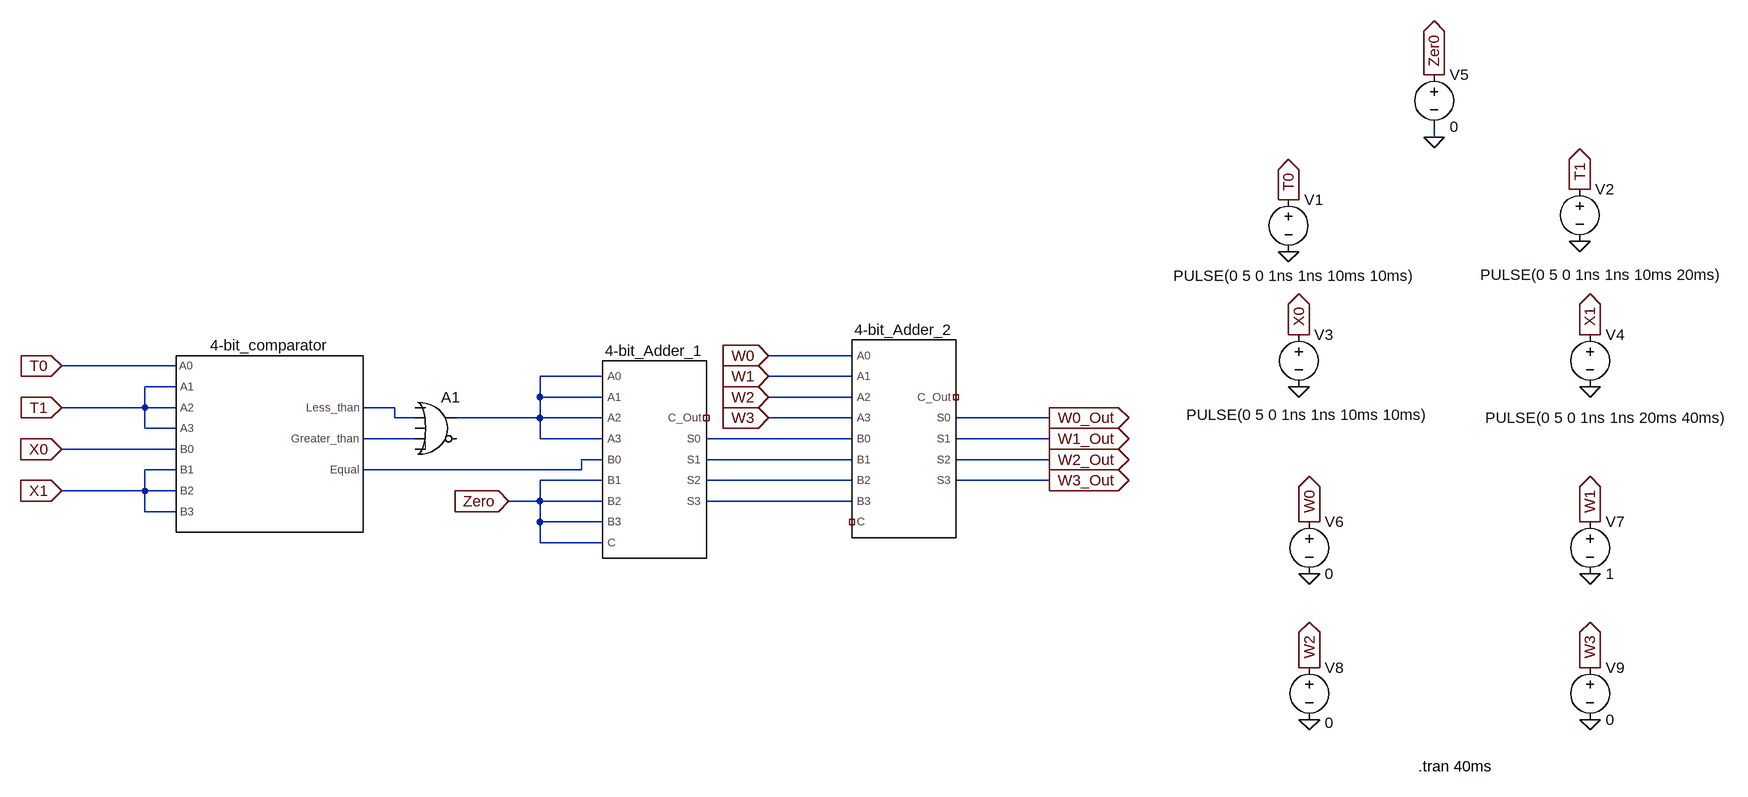
[diagram p0: schematic P2_Perceptron.asc]
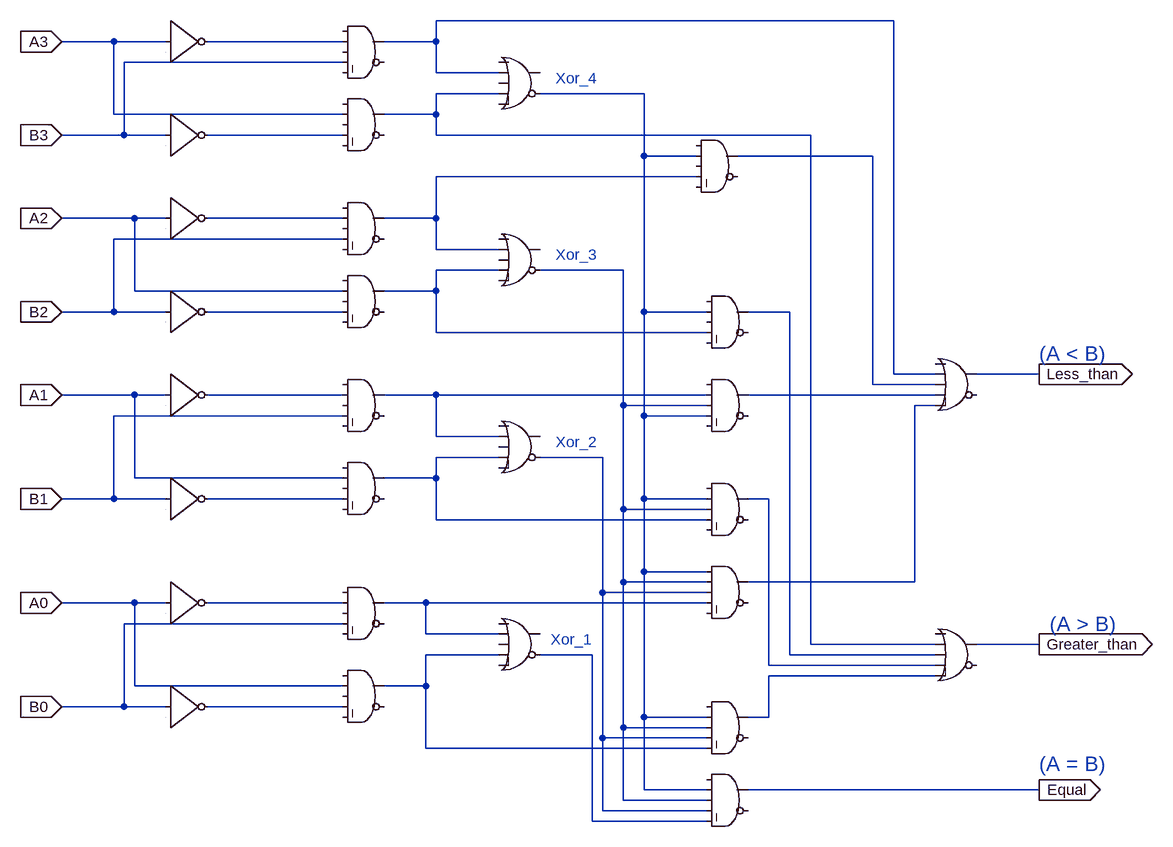
[diagram p1: sub-circuit 4-bit_comparator.asc]
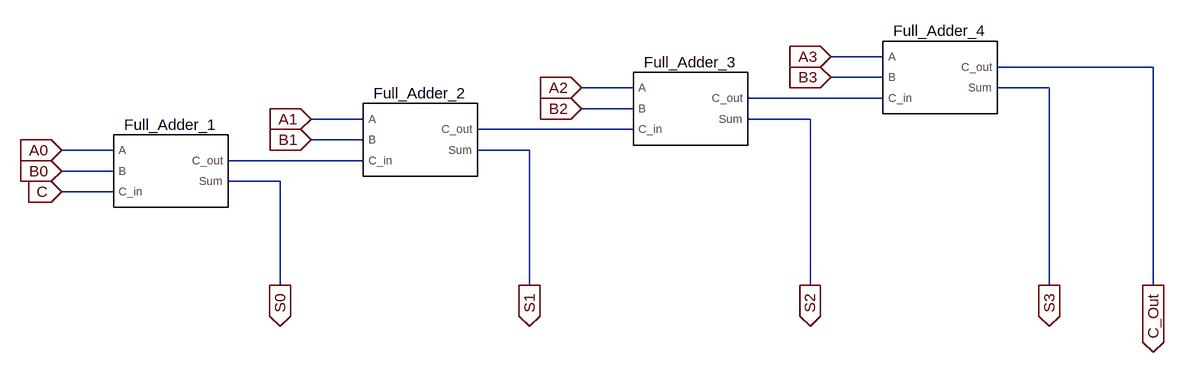
[diagram p2: sub-circuit 4-bit_adder.asc]
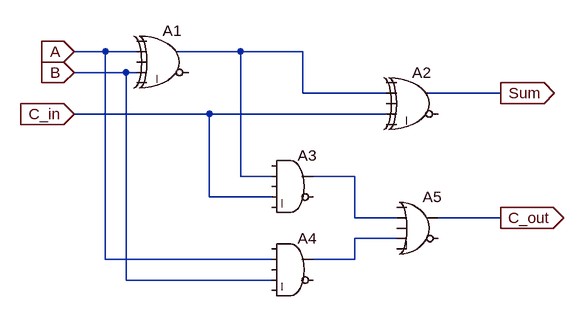
[diagram p3: sub-circuit full_adder.asc]
P2_Perceptron.asc, the LTspice schematic file:
Version 4
SHEET 1 2160 1016
WIRE 1488 -368 1488 -384
WIRE 592 -32 464 -32
WIRE -448 -16 -624 -16
WIRE 208 0 112 0
WIRE 592 0 464 0
WIRE -448 16 -496 16
WIRE 112 32 112 0
WIRE 208 32 112 32
WIRE 592 32 464 32
WIRE -496 48 -496 16
WIRE -496 48 -624 48
WIRE -448 48 -496 48
WIRE -112 48 -160 48
WIRE -112 64 -112 48
WIRE -80 64 -112 64
WIRE 112 64 112 32
WIRE 112 64 -16 64
WIRE 208 64 112 64
WIRE 592 64 464 64
WIRE 896 64 752 64
WIRE -496 80 -496 48
WIRE -448 80 -496 80
WIRE -80 96 -160 96
WIRE 112 96 112 64
WIRE 208 96 112 96
WIRE 592 96 368 96
WIRE 896 96 752 96
WIRE -448 112 -624 112
WIRE 208 128 176 128
WIRE 592 128 368 128
WIRE 896 128 752 128
WIRE -448 144 -496 144
WIRE 176 144 176 128
WIRE 176 144 -160 144
WIRE 208 160 112 160
WIRE 592 160 368 160
WIRE 896 160 752 160
WIRE -496 176 -496 144
WIRE -496 176 -624 176
WIRE -448 176 -496 176
WIRE 112 192 112 160
WIRE 112 192 64 192
WIRE 208 192 112 192
WIRE 592 192 368 192
WIRE -496 208 -496 176
WIRE -448 208 -496 208
WIRE 112 224 112 192
WIRE 208 224 112 224
WIRE 112 256 112 224
WIRE 208 256 112 256
FLAG -624 -16 T0
IOPIN -624 -16 In
FLAG -624 48 T1
IOPIN -624 48 In
FLAG -624 112 X0
IOPIN -624 112 In
FLAG -624 176 X1
IOPIN -624 176 In
FLAG 64 192 Zero
IOPIN 64 192 In
FLAG 464 -32 W0
IOPIN 464 -32 In
FLAG 464 0 W1
IOPIN 464 0 In
FLAG 464 32 W2
IOPIN 464 32 In
FLAG 464 64 W3
IOPIN 464 64 In
FLAG 896 64 W0_Out
IOPIN 896 64 Out
FLAG 896 96 W1_Out
IOPIN 896 96 Out
FLAG 896 128 W2_Out
IOPIN 896 128 Out
FLAG 896 160 W3_Out
IOPIN 896 160 Out
FLAG 1264 -192 0
FLAG 1712 -208 0
FLAG 1280 16 0
FLAG 1728 16 0
FLAG 1488 -368 0
FLAG 1728 528 0
FLAG 1296 528 0
FLAG 1728 304 0
FLAG 1296 304 0
FLAG 1264 -272 T0
IOPIN 1264 -272 Out
FLAG 1712 -288 T1
IOPIN 1712 -288 Out
FLAG 1280 -64 X0
IOPIN 1280 -64 Out
FLAG 1728 -64 X1
IOPIN 1728 -64 Out
FLAG 1488 -464 Zer0
IOPIN 1488 -464 Out
FLAG 1728 448 W3
IOPIN 1728 448 Out
FLAG 1296 448 W2
IOPIN 1296 448 Out
FLAG 1728 224 W1
IOPIN 1728 224 Out
FLAG 1296 224 W0
IOPIN 1296 224 Out
SYMBOL Digital\\or -48 16 R0
SYMATTR InstName A1
SYMBOL voltage 1264 -288 R0
WINDOW 3 -177 133 Left 2
WINDOW 123 0 0 Left 0
WINDOW 39 0 0 Left 0
SYMATTR Value PULSE(0 5 0 1ns 1ns 10ms 10ms)
SYMATTR InstName V1
SYMBOL voltage 1712 -304 R0
WINDOW 3 -153 148 Left 2
WINDOW 123 0 0 Left 0
WINDOW 39 0 0 Left 0
SYMATTR Value PULSE(0 5 0 1ns 1ns 10ms 20ms)
SYMATTR InstName V2
SYMBOL voltage 1280 -80 R0
WINDOW 3 -173 139 Left 2
WINDOW 123 0 0 Left 0
WINDOW 39 0 0 Left 0
SYMATTR Value PULSE(0 5 0 1ns 1ns 10ms 10ms)
SYMATTR InstName V3
SYMBOL voltage 1728 -80 R0
WINDOW 3 -161 144 Left 2
WINDOW 123 0 0 Left 0
WINDOW 39 0 0 Left 0
SYMATTR Value PULSE(0 5 0 1ns 1ns 20ms 40ms)
SYMATTR InstName V4
SYMBOL voltage 1488 -480 R0
WINDOW 123 0 0 Left 0
WINDOW 39 0 0 Left 0
SYMATTR InstName V5
SYMATTR Value 0
SYMBOL voltage 1296 208 R0
WINDOW 123 0 0 Left 0
WINDOW 39 0 0 Left 0
SYMATTR InstName V6
SYMATTR Value 0
SYMBOL voltage 1728 208 R0
WINDOW 123 0 0 Left 0
WINDOW 39 0 0 Left 0
SYMATTR InstName V7
SYMATTR Value 1
SYMBOL voltage 1296 432 R0
WINDOW 123 0 0 Left 0
WINDOW 39 0 0 Left 0
WINDOW 3 24 101 Left 2
SYMATTR Value 0
SYMATTR InstName V8
SYMBOL voltage 1728 432 R0
WINDOW 123 0 0 Left 0
WINDOW 39 0 0 Left 0
SYMATTR InstName V9
SYMATTR Value 0
SYMBOL 4-bit_comparator -336 96 R0
WINDOW 0 32 -128 Bottom 2
SYMATTR InstName 4-bit_comparator
SYMBOL 4-bit_Adder 256 128 R0
SYMATTR InstName 4-bit_Adder_1
SYMBOL 4-bit_Adder 640 96 R0
SYMATTR InstName 4-bit_Adder_2
TEXT 1464 600 Left 2 !.tran 40ms

4-bit_comparator.asc, the sub-circuit schematic file:
Version 4
SHEET 1 2408 1296
WIRE 1152 16 448 16
WIRE -48 48 -128 48
WIRE 32 48 -48 48
WIRE 304 48 96 48
WIRE 448 48 448 16
WIRE 448 48 368 48
WIRE 304 80 -32 80
WIRE 448 96 448 48
WIRE 544 96 448 96
WIRE 544 128 448 128
WIRE 768 128 608 128
WIRE -48 160 -48 48
WIRE 304 160 -48 160
WIRE 448 160 448 128
WIRE 448 160 368 160
WIRE -32 192 -32 80
WIRE -32 192 -128 192
WIRE 32 192 -32 192
WIRE 304 192 96 192
WIRE 448 192 448 160
WIRE 1024 192 448 192
WIRE 768 224 768 128
WIRE 848 224 768 224
WIRE 1120 224 912 224
WIRE 848 256 448 256
WIRE -16 320 -128 320
WIRE 32 320 -16 320
WIRE 304 320 96 320
WIRE 448 320 448 256
WIRE 448 320 368 320
WIRE 304 352 -48 352
WIRE 448 368 448 320
WIRE 544 368 448 368
WIRE 544 400 448 400
WIRE 736 400 608 400
WIRE -16 432 -16 320
WIRE 304 432 -16 432
WIRE 448 432 448 400
WIRE 448 432 368 432
WIRE -48 464 -48 352
WIRE -48 464 -128 464
WIRE 32 464 -48 464
WIRE 304 464 96 464
WIRE 768 464 768 224
WIRE 864 464 768 464
WIRE 992 464 928 464
WIRE 448 496 448 432
WIRE 864 496 448 496
WIRE 1152 560 1152 16
WIRE 1216 560 1152 560
WIRE 1376 560 1280 560
WIRE 1120 576 1120 224
WIRE 1216 576 1120 576
WIRE -16 592 -128 592
WIRE 32 592 -16 592
WIRE 304 592 96 592
WIRE 448 592 368 592
WIRE 864 592 448 592
WIRE 1216 592 928 592
WIRE 736 608 736 400
WIRE 864 608 736 608
WIRE 1216 608 1184 608
WIRE 304 624 -48 624
WIRE 768 624 768 464
WIRE 864 624 768 624
WIRE 448 656 448 592
WIRE 544 656 448 656
WIRE 544 688 448 688
WIRE 704 688 608 688
WIRE -16 720 -16 592
WIRE 304 720 -16 720
WIRE 448 720 448 688
WIRE 448 720 368 720
WIRE -48 752 -48 624
WIRE -48 752 -128 752
WIRE 32 752 -48 752
WIRE 304 752 96 752
WIRE 768 752 768 624
WIRE 864 752 768 752
WIRE 960 752 928 752
WIRE 736 768 736 608
WIRE 864 768 736 768
WIRE 448 784 448 720
WIRE 864 784 448 784
WIRE 768 864 768 752
WIRE 864 864 768 864
WIRE 736 880 736 768
WIRE 864 880 736 880
WIRE 1184 880 1184 608
WIRE 1184 880 928 880
WIRE 704 896 704 688
WIRE 864 896 704 896
WIRE -16 912 -128 912
WIRE 32 912 -16 912
WIRE 304 912 96 912
WIRE 432 912 368 912
WIRE 864 912 432 912
WIRE 304 944 -32 944
WIRE 432 960 432 912
WIRE 544 960 432 960
WIRE 1024 976 1024 192
WIRE 1216 976 1024 976
WIRE 1376 976 1280 976
WIRE 544 992 432 992
WIRE 688 992 608 992
WIRE 992 992 992 464
WIRE 1216 992 992 992
WIRE 960 1008 960 752
WIRE 1216 1008 960 1008
WIRE 1216 1024 960 1024
WIRE -16 1040 -16 912
WIRE 304 1040 -16 1040
WIRE 432 1040 432 992
WIRE 432 1040 368 1040
WIRE -32 1072 -32 944
WIRE -32 1072 -128 1072
WIRE 32 1072 -32 1072
WIRE 304 1072 96 1072
WIRE 768 1088 768 864
WIRE 864 1088 768 1088
WIRE 960 1088 960 1024
WIRE 960 1088 928 1088
WIRE 736 1104 736 880
WIRE 864 1104 736 1104
WIRE 704 1120 704 896
WIRE 864 1120 704 1120
WIRE 432 1136 432 1040
WIRE 864 1136 432 1136
WIRE 768 1200 768 1088
WIRE 864 1200 768 1200
WIRE 1376 1200 928 1200
WIRE 736 1216 736 1104
WIRE 864 1216 736 1216
WIRE 704 1232 704 1120
WIRE 864 1232 704 1232
WIRE 688 1248 688 992
WIRE 864 1248 688 1248
FLAG -128 48 A3
IOPIN -128 48 In
FLAG -128 192 B3
IOPIN -128 192 In
FLAG -128 320 A2
IOPIN -128 320 In
FLAG -128 464 B2
IOPIN -128 464 In
FLAG -128 592 A1
IOPIN -128 592 In
FLAG -128 752 B1
IOPIN -128 752 In
FLAG -128 912 A0
IOPIN -128 912 In
FLAG -128 1072 B0
IOPIN -128 1072 In
FLAG 1376 560 Less_than
IOPIN 1376 560 Out
FLAG 1376 976 Greater_than
IOPIN 1376 976 Out
FLAG 1376 1200 Equal
IOPIN 1376 1200 Out
SYMBOL Digital\\inv 32 -16 R0
WINDOW 0 8 32 Invisible 2
SYMATTR InstName A1
SYMBOL Digital\\inv 32 128 R0
WINDOW 0 8 32 Invisible 2
SYMATTR InstName A2
SYMBOL Digital\\inv 32 256 R0
WINDOW 0 8 32 Invisible 2
SYMATTR InstName A3
SYMBOL Digital\\inv 32 400 R0
WINDOW 0 8 32 Invisible 2
SYMATTR InstName A4
SYMBOL Digital\\inv 32 528 R0
WINDOW 0 8 32 Invisible 2
SYMATTR InstName A5
SYMBOL Digital\\inv 32 688 R0
WINDOW 0 8 32 Invisible 2
SYMATTR InstName A6
SYMBOL Digital\\inv 32 848 R0
WINDOW 0 8 32 Invisible 2
SYMATTR InstName A7
SYMBOL Digital\\inv 32 1008 R0
WINDOW 0 8 32 Invisible 2
SYMATTR InstName A8
SYMBOL Digital\\and 336 0 R0
WINDOW 0 16 24 Invisible 2
SYMATTR InstName A9
SYMBOL Digital\\and 336 112 R0
WINDOW 0 16 24 Invisible 2
SYMATTR InstName A10
SYMBOL Digital\\and 336 272 R0
WINDOW 0 16 24 Invisible 2
SYMATTR InstName A11
SYMBOL Digital\\and 336 384 R0
WINDOW 0 16 24 Invisible 2
SYMATTR InstName A12
SYMBOL Digital\\and 336 544 R0
WINDOW 0 16 24 Invisible 2
SYMATTR InstName A13
SYMBOL Digital\\and 336 672 R0
WINDOW 0 16 24 Invisible 2
SYMATTR InstName A14
SYMBOL Digital\\and 336 864 R0
WINDOW 0 16 24 Invisible 2
SYMATTR InstName A15
SYMBOL Digital\\and 336 992 R0
WINDOW 0 16 24 Invisible 2
SYMATTR InstName A16
SYMBOL Digital\\or 576 48 R0
WINDOW 0 -8 8 Invisible 2
SYMATTR InstName A17
SYMBOL Digital\\or 576 320 R0
WINDOW 0 -8 8 Invisible 2
SYMATTR InstName A18
SYMBOL Digital\\or 576 608 R0
WINDOW 0 -8 8 Invisible 2
SYMATTR InstName A19
SYMBOL Digital\\or 576 912 R0
WINDOW 0 -8 8 Invisible 2
SYMATTR InstName A20
SYMBOL Digital\\and 880 176 R0
WINDOW 0 16 24 Invisible 2
SYMATTR InstName A21
SYMBOL Digital\\and 896 416 R0
WINDOW 0 16 24 Invisible 2
SYMATTR InstName A22
SYMBOL Digital\\and 896 544 R0
WINDOW 0 16 24 Invisible 2
SYMATTR InstName A23
SYMBOL Digital\\and 896 704 R0
WINDOW 0 16 24 Invisible 2
SYMATTR InstName A24
SYMBOL Digital\\and 896 832 R0
WINDOW 0 16 24 Invisible 2
SYMATTR InstName A25
SYMBOL Digital\\and 896 1040 R0
WINDOW 0 16 24 Invisible 2
SYMATTR InstName A26
SYMBOL Digital\\and 896 1152 R0
WINDOW 0 16 24 Invisible 2
SYMATTR InstName A27
SYMBOL Digital\\or 1248 512 R0
WINDOW 0 -8 8 Invisible 2
SYMATTR InstName A28
SYMBOL Digital\\or 1248 928 R0
WINDOW 0 -8 8 Invisible 2
SYMATTR InstName A29
TEXT 624 968 Left 2 ;Xor_1
TEXT 632 664 Left 2 ;Xor_2
TEXT 632 376 Left 2 ;Xor_3
TEXT 632 104 Left 2 ;Xor_4
TEXT 1376 528 Left 3 ;(A < B)
TEXT 1392 944 Left 3 ;(A > B)
TEXT 1376 1160 Left 3 ;(A = B)

4-bit_adder.asc, the sub-circuit schematic file:
Version 4
SHEET 1 1200 1108
WIRE 672 160 592 160
WIRE 1088 176 848 176
WIRE 672 192 592 192
WIRE 288 208 208 208
WIRE 928 208 848 208
WIRE 672 224 464 224
WIRE 288 240 208 240
WIRE -128 256 -208 256
WIRE 560 256 464 256
WIRE 288 272 48 272
WIRE -128 288 -208 288
WIRE -512 304 -592 304
WIRE 128 304 48 304
WIRE -128 320 -336 320
WIRE -512 336 -592 336
WIRE -256 352 -336 352
WIRE -512 368 -592 368
WIRE -256 512 -256 352
WIRE 128 512 128 304
WIRE 560 512 560 256
WIRE 928 512 928 208
WIRE 1088 512 1088 176
FLAG -592 304 A0
IOPIN -592 304 In
FLAG -208 256 A1
IOPIN -208 256 In
FLAG 208 208 A2
IOPIN 208 208 In
FLAG 592 160 A3
IOPIN 592 160 In
FLAG 592 192 B3
IOPIN 592 192 In
FLAG 208 240 B2
IOPIN 208 240 In
FLAG -208 288 B1
IOPIN -208 288 In
FLAG -592 336 B0
IOPIN -592 336 In
FLAG 128 512 S1
IOPIN 128 512 Out
FLAG 560 512 S2
IOPIN 560 512 Out
FLAG 928 512 S3
IOPIN 928 512 Out
FLAG -256 512 S0
IOPIN -256 512 Out
FLAG 1088 512 C_Out
IOPIN 1088 512 Out
FLAG -592 368 C
IOPIN -592 368 In
SYMBOL Full_Adder -432 336 R0
SYMATTR InstName Full_Adder_1
SYMBOL Full_Adder -48 288 R0
SYMATTR InstName Full_Adder_2
SYMBOL Full_Adder 368 240 R0
SYMATTR InstName Full_Adder_3
SYMBOL Full_Adder 752 192 R0
SYMATTR InstName Full_Adder_4

full_adder.asc, the sub-circuit schematic file:
Version 4
SHEET 1 880 708
WIRE -96 64 -144 64
WIRE -48 64 -96 64
WIRE 112 64 16 64
WIRE 208 64 112 64
WIRE -64 96 -144 96
WIRE -48 96 -64 96
WIRE 208 128 208 64
WIRE 336 128 208 128
WIRE 512 128 400 128
WIRE 64 160 -144 160
WIRE 336 160 64 160
WIRE 112 256 112 64
WIRE 160 256 112 256
WIRE 288 256 224 256
WIRE 64 288 64 160
WIRE 160 288 64 288
WIRE 288 320 288 256
WIRE 352 320 288 320
WIRE 512 320 416 320
WIRE 352 352 288 352
WIRE -96 384 -96 64
WIRE 160 384 -96 384
WIRE 288 384 288 352
WIRE 288 384 224 384
WIRE -64 416 -64 96
WIRE 160 416 -64 416
FLAG -144 64 A
IOPIN -144 64 In
FLAG -144 96 B
IOPIN -144 96 In
FLAG -144 160 C_in
IOPIN -144 160 In
FLAG 512 128 Sum
IOPIN 512 128 Out
FLAG 512 320 C_out
IOPIN 512 320 Out
SYMBOL Digital\\xor 0 16 R0
SYMATTR InstName A1
SYMBOL Digital\\xor 384 80 R0
SYMATTR InstName A2
SYMBOL Digital\\and 192 208 R0
SYMATTR InstName A3
SYMBOL Digital\\and 192 336 R0
SYMATTR InstName A4
SYMBOL Digital\\or 384 272 R0
SYMATTR InstName A5

The netlist it stands for:
* P2_Perceptron.asc
A1 0 N002 0 N003 0 0 N001 0 OR
V1 T0 0 PULSE(0 5 0 1ns 1ns 10ms 10ms)
V2 T1 0 PULSE(0 5 0 1ns 1ns 10ms 20ms)
V3 X0 0 PULSE(0 5 0 1ns 1ns 10ms 10ms)
V4 X1 0 PULSE(0 5 0 1ns 1ns 20ms 40ms)
V5 Zer0 0 0
V6 W0 0 0
V7 W1 0 1
V8 W2 0 0
V9 W3 0 0
X4-bit_comparator T0 T1 T1 T1 X0 X1 X1 X1 N002 N003 N005 4-bit_comparator
X4-bit_Adder_1 N001 N001 N001 N001 N005 Zero Zero Zero Zero NC_01 N004 N006 N007 N008 4-bit_adder
X4-bit_Adder_2 W0 W1 W2 W3 N004 N006 N007 N008 NC_02 NC_03 W0_Out W1_Out W2_Out W3_Out 4-bit_adder

* block symbol definitions
.subckt 4-bit_comparator A0 A1 A2 A3 B0 B1 B2 B3 Less_than Greater_than Equal
A1 A3 0 0 0 0 N002 0 0 BUF
A2 B3 0 0 0 0 N005 0 0 BUF
A3 A2 0 0 0 0 N008 0 0 BUF
A4 B2 0 0 0 0 N011 0 0 BUF
A5 A1 0 0 0 0 N013 0 0 BUF
A6 B1 0 0 0 0 N019 0 0 BUF
A7 A0 0 0 0 0 N021 0 0 BUF
A8 B0 0 0 0 0 N026 0 0 BUF
A9 0 N002 0 B3 0 0 N001 0 AND
A10 0 A3 0 N005 0 0 N003 0 AND
A11 0 N008 0 B2 0 0 N007 0 AND
A12 0 A2 0 N011 0 0 N009 0 AND
A13 0 N013 0 B1 0 0 N014 0 AND
A14 0 A1 0 N019 0 0 N017 0 AND
A15 0 N021 0 B0 0 0 N022 0 AND
A16 0 A0 0 N026 0 0 N023 0 AND
A17 0 N001 0 N003 0 N004 0 0 OR
A18 0 N007 0 N009 0 N010 0 0 OR
A19 0 N014 0 N017 0 N018 0 0 OR
A20 0 N022 0 N023 0 N024 0 0 OR
A21 0 N004 0 N007 0 0 N006 0 AND
A22 0 N004 0 N009 0 0 N012 0 AND
A23 0 N014 N010 N004 0 0 N015 0 AND
A24 0 N004 N010 N017 0 0 N020 0 AND
A25 N004 N010 N018 N022 0 0 N016 0 AND
A26 0 N004 N010 N018 N023 0 N025 0 AND
A27 0 N004 N010 N018 N024 0 Equal 0 AND
A28 0 N001 N006 N015 N016 0 Less_than 0 OR
A29 0 N003 N012 N020 N025 0 Greater_than 0 OR
* Xor_1
* Xor_2
* Xor_3
* Xor_4
* (A < B)
* (A > B)
* (A = B)
.ends 4-bit_comparator

.subckt 4-bit_adder A0 A1 A2 A3 B0 B1 B2 B3 C C_Out S0 S1 S2 S3
XFull_Adder_1 A0 B0 C N003 S0 full_adder
XFull_Adder_2 A1 B1 N003 N002 S1 full_adder
XFull_Adder_3 A2 B2 N002 N001 S2 full_adder
XFull_Adder_4 A3 B3 N001 C_Out S3 full_adder
.ends 4-bit_adder

.subckt full_adder A B C_in C_out Sum
A1 0 A 0 B 0 0 N001 0 XOR
A2 0 N001 0 C_in 0 0 Sum 0 XOR
A3 0 N001 0 C_in 0 0 N002 0 AND
A4 0 A 0 B 0 0 N003 0 AND
A5 0 N002 0 N003 0 0 C_out 0 OR
.ends full_adder

.tran 40ms
.backanno
.end